# Altium schematic sheet music_51.SchDoc
size A3; Organization: Altium Limited; Address1: L3, 12a Rodborough Rd; Address2: Frenchs Forest; Address3: NSW; Address4: Australia 2086
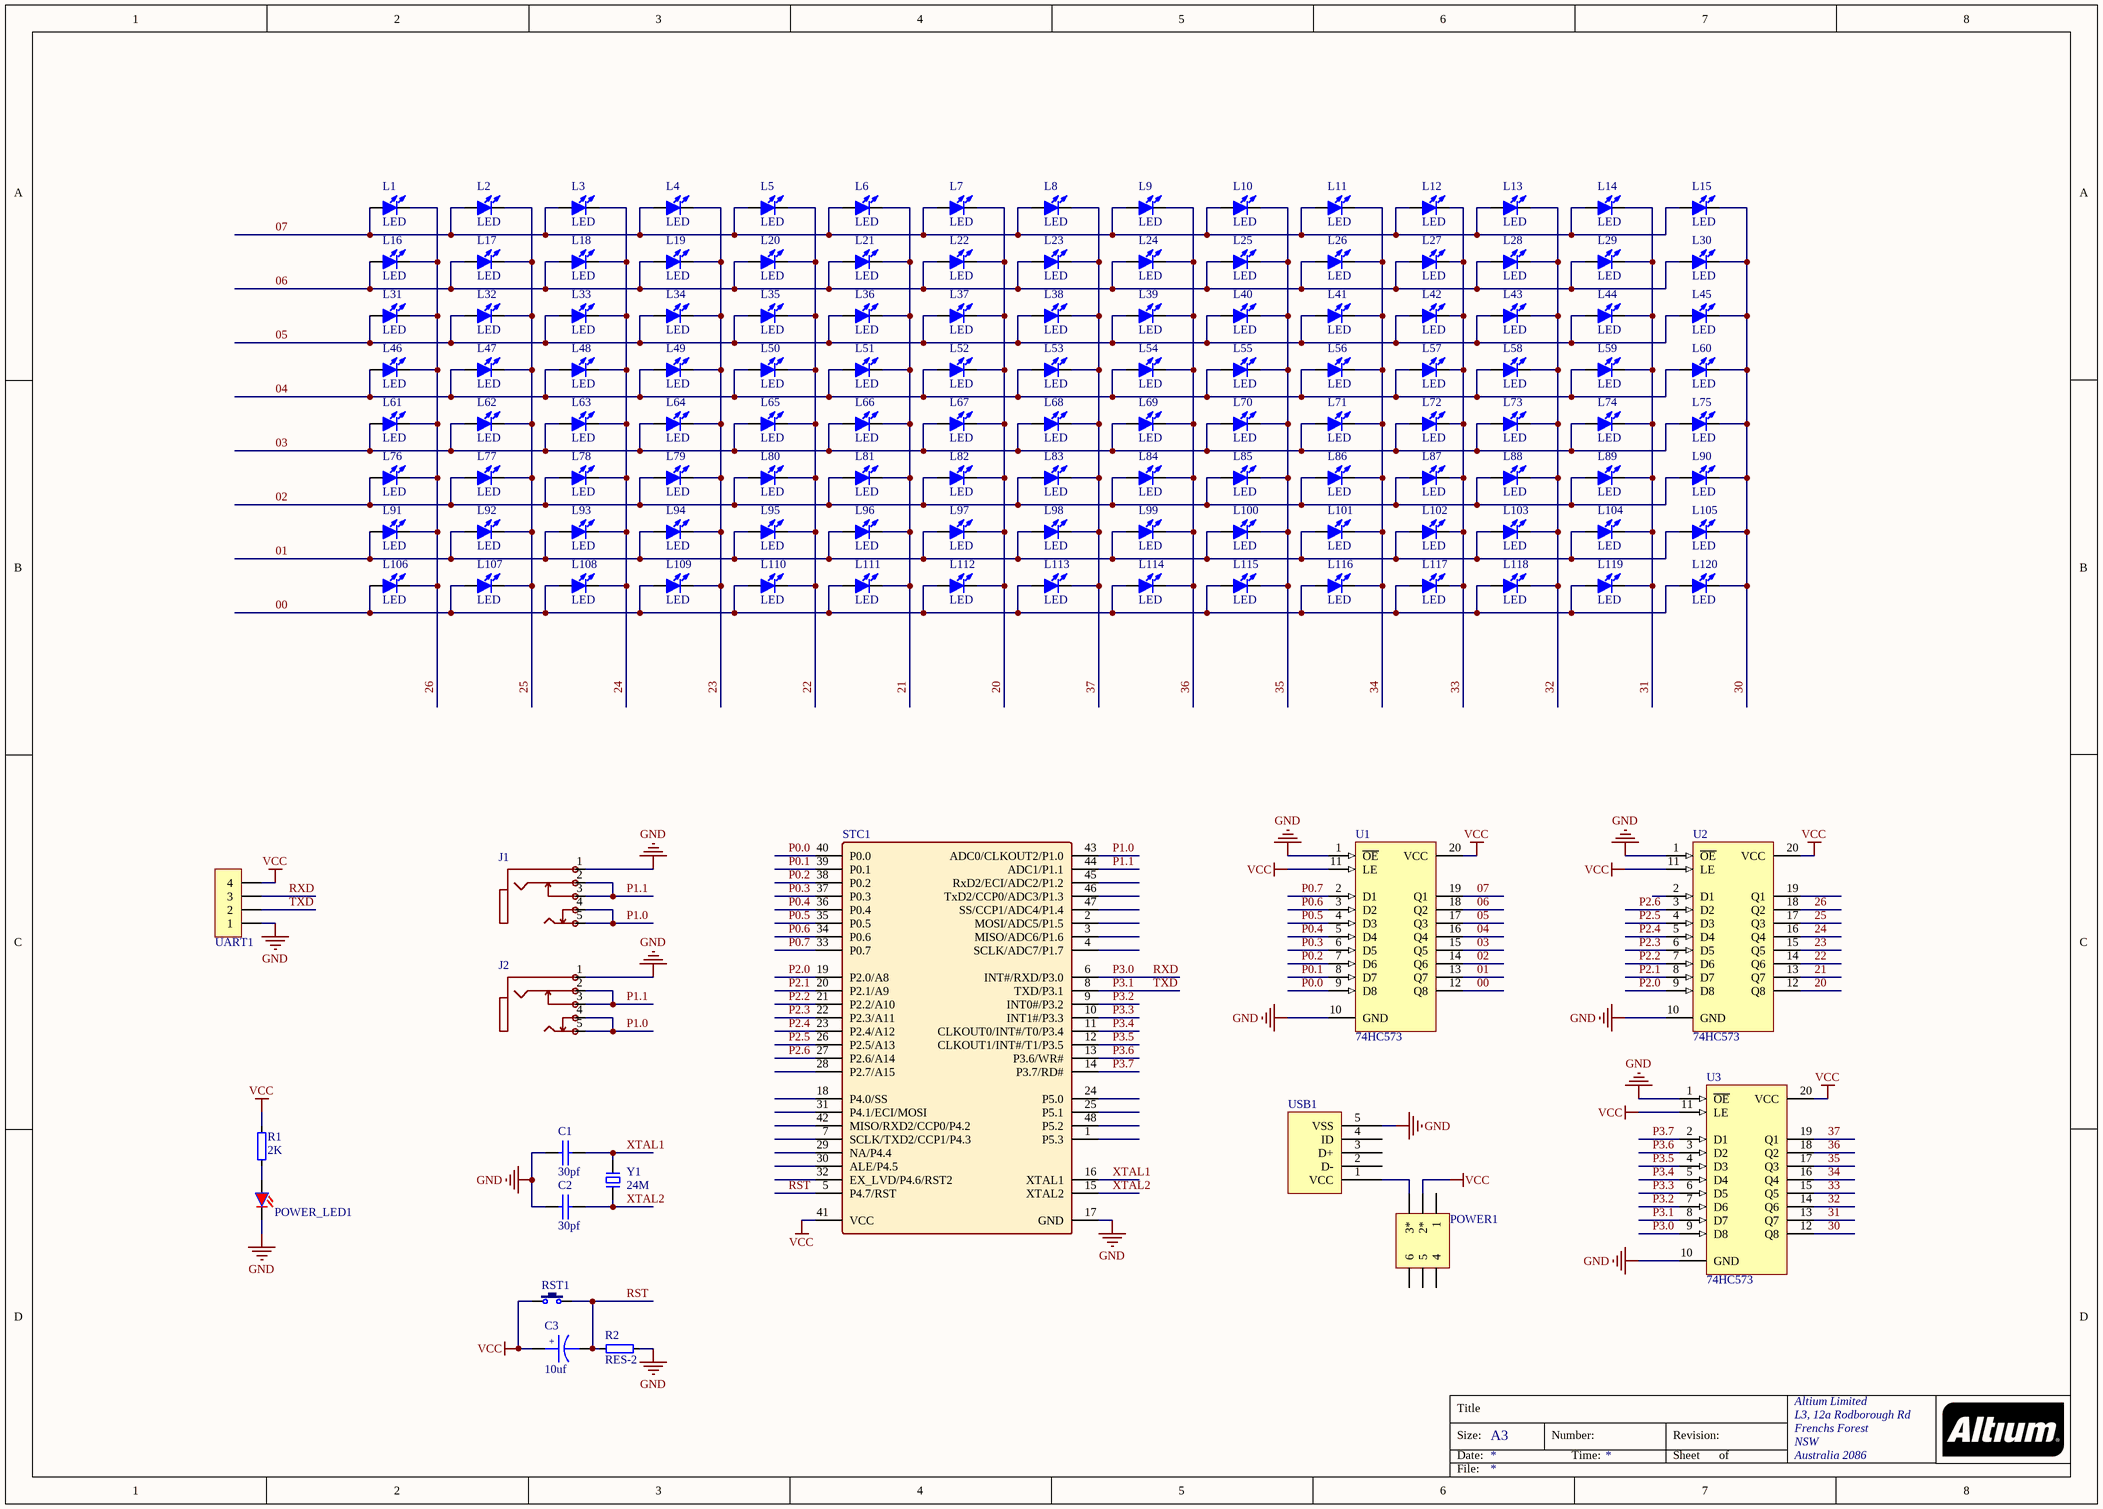
[diagram p0: music_51.SchDoc]

## Parts
C1  30pf  [CAP-0805]
C2  30pf  [CAP-0805]
C3  10uf  [CAP-0805]
J1  PJ-307C  [PJ-307C]  (value not drawn)
J2  PJ-307C  [PJ-307C]  (value not drawn)
L1  LED  [LED]
L2  LED  [LED]
L3  LED  [LED]
L4  LED  [LED]
L5  LED  [LED]
L6  LED  [LED]
L7  LED  [LED]
L8  LED  [LED]
L9  LED  [LED]
L10  LED  [LED]
L11  LED  [LED]
L12  LED  [LED]
L13  LED  [LED]
L14  LED  [LED]
L15  LED  [LED]
L16  LED  [LED]
L17  LED  [LED]
L18  LED  [LED]
L19  LED  [LED]
L20  LED  [LED]
L21  LED  [LED]
L22  LED  [LED]
L23  LED  [LED]
L24  LED  [LED]
L25  LED  [LED]
L26  LED  [LED]
L27  LED  [LED]
L28  LED  [LED]
L29  LED  [LED]
L30  LED  [LED]
L31  LED  [LED]
L32  LED  [LED]
L33  LED  [LED]
L34  LED  [LED]
L35  LED  [LED]
L36  LED  [LED]
L37  LED  [LED]
L38  LED  [LED]
L39  LED  [LED]
L40  LED  [LED]
L41  LED  [LED]
L42  LED  [LED]
L43  LED  [LED]
L44  LED  [LED]
L45  LED  [LED]
L46  LED  [LED]
L47  LED  [LED]
L48  LED  [LED]
L49  LED  [LED]
L50  LED  [LED]
L51  LED  [LED]
L52  LED  [LED]
L53  LED  [LED]
L54  LED  [LED]
L55  LED  [LED]
L56  LED  [LED]
L57  LED  [LED]
L58  LED  [LED]
L59  LED  [LED]
L60  LED  [LED]
L61  LED  [LED]
L62  LED  [LED]
L63  LED  [LED]
L64  LED  [LED]
L65  LED  [LED]
L66  LED  [LED]
L67  LED  [LED]
L68  LED  [LED]
L69  LED  [LED]
L70  LED  [LED]
L71  LED  [LED]
L72  LED  [LED]
L73  LED  [LED]
L74  LED  [LED]
L75  LED  [LED]
L76  LED  [LED]
L77  LED  [LED]
L78  LED  [LED]
L79  LED  [LED]
L80  LED  [LED]
L81  LED  [LED]
L82  LED  [LED]
L83  LED  [LED]
L84  LED  [LED]
L85  LED  [LED]
L86  LED  [LED]
L87  LED  [LED]
L88  LED  [LED]
L89  LED  [LED]
L90  LED  [LED]
L91  LED  [LED]
L92  LED  [LED]
L93  LED  [LED]
L94  LED  [LED]
L95  LED  [LED]
L96  LED  [LED]
L97  LED  [LED]
L98  LED  [LED]
L99  LED  [LED]
L100  LED  [LED]
L101  LED  [LED]
L102  LED  [LED]
L103  LED  [LED]
L104  LED  [LED]
L105  LED  [LED]
L106  LED  [LED]
L107  LED  [LED]
L108  LED  [LED]
L109  LED  [LED]
L110  LED  [LED]
L111  LED  [LED]
L112  LED  [LED]
L113  LED  [LED]
L114  LED  [LED]
L115  LED  [LED]
L116  LED  [LED]
L117  LED  [LED]
L118  LED  [LED]
L119  LED  [LED]
L120  LED  [LED]
POWER1  SWITCH  [KEY6]  (value not drawn)
POWER_LED1  LED_Red  [LED]  (value not drawn)
R1  2K  [RES-S0805]
R2  RES-2  [RES-S0805]
RST1  Key  [KEY4]  (value not drawn)
STC1  STC12C5A60S2  [LQPF48_7*7]  (value not drawn)
U1  74HC573  [SOIC-20]
U2  74HC573  [SOIC-20]
U3  74HC573  [SOIC-20]
UART1  Header 1*4  [Header 1*4]  (value not drawn)
USB1  USB_M  [MICRO_USB]  (value not drawn)
Y1  24M  [XTAL]

## Nets
GND: C1.2 C2.1 J1.1 J2.1 POWER_LED1.2(K) R2.2 STC1.17(GND) U1.1(~{OE}) U1.10(GND) U2.1(~{OE}) U2.10(GND) U3.1(~{OE}) U3.10(GND) UART1.1 USB1.5(VSS)
VCC: C3.1 POWER1.2(2*) R1.1 RST1.1 STC1.41(VCC) U1.11(LE) U1.20(VCC) U2.11(LE) U2.20(VCC) U3.11(LE) U3.20(VCC) UART1.4
00: L106.1(A) L107.1(A) L108.1(A) L109.1(A) L110.1(A) L111.1(A) L112.1(A) L113.1(A) L114.1(A) L115.1(A) L116.1(A) L117.1(A) L118.1(A) L119.1(A) L120.1(A) U1.12(Q8)
01: L91.1(A) L92.1(A) L93.1(A) L94.1(A) L95.1(A) L96.1(A) L97.1(A) L98.1(A) L99.1(A) L100.1(A) L101.1(A) L102.1(A) L103.1(A) L104.1(A) L105.1(A) U1.13(Q7)
02: L76.1(A) L77.1(A) L78.1(A) L79.1(A) L80.1(A) L81.1(A) L82.1(A) L83.1(A) L84.1(A) L85.1(A) L86.1(A) L87.1(A) L88.1(A) L89.1(A) L90.1(A) U1.14(Q6)
03: L61.1(A) L62.1(A) L63.1(A) L64.1(A) L65.1(A) L66.1(A) L67.1(A) L68.1(A) L69.1(A) L70.1(A) L71.1(A) L72.1(A) L73.1(A) L74.1(A) L75.1(A) U1.15(Q5)
04: L46.1(A) L47.1(A) L48.1(A) L49.1(A) L50.1(A) L51.1(A) L52.1(A) L53.1(A) L54.1(A) L55.1(A) L56.1(A) L57.1(A) L58.1(A) L59.1(A) L60.1(A) U1.16(Q4)
05: L31.1(A) L32.1(A) L33.1(A) L34.1(A) L35.1(A) L36.1(A) L37.1(A) L38.1(A) L39.1(A) L40.1(A) L41.1(A) L42.1(A) L43.1(A) L44.1(A) L45.1(A) U1.17(Q3)
06: L16.1(A) L17.1(A) L18.1(A) L19.1(A) L20.1(A) L21.1(A) L22.1(A) L23.1(A) L24.1(A) L25.1(A) L26.1(A) L27.1(A) L28.1(A) L29.1(A) L30.1(A) U1.18(Q2)
07: L1.1(A) L2.1(A) L3.1(A) L4.1(A) L5.1(A) L6.1(A) L7.1(A) L8.1(A) L9.1(A) L10.1(A) L11.1(A) L12.1(A) L13.1(A) L14.1(A) L15.1(A) U1.19(Q1)
20: L7.2(K) L22.2(K) L37.2(K) L52.2(K) L67.2(K) L82.2(K) L97.2(K) L112.2(K) U2.12(Q8)
21: L6.2(K) L21.2(K) L36.2(K) L51.2(K) L66.2(K) L81.2(K) L96.2(K) L111.2(K) U2.13(Q7)
22: L5.2(K) L20.2(K) L35.2(K) L50.2(K) L65.2(K) L80.2(K) L95.2(K) L110.2(K) U2.14(Q6)
23: L4.2(K) L19.2(K) L34.2(K) L49.2(K) L64.2(K) L79.2(K) L94.2(K) L109.2(K) U2.15(Q5)
24: L3.2(K) L18.2(K) L33.2(K) L48.2(K) L63.2(K) L78.2(K) L93.2(K) L108.2(K) U2.16(Q4)
25: L2.2(K) L17.2(K) L32.2(K) L47.2(K) L62.2(K) L77.2(K) L92.2(K) L107.2(K) U2.17(Q3)
26: L1.2(K) L16.2(K) L31.2(K) L46.2(K) L61.2(K) L76.2(K) L91.2(K) L106.2(K) U2.18(Q2)
30: L15.2(K) L30.2(K) L45.2(K) L60.2(K) L75.2(K) L90.2(K) L105.2(K) L120.2(K) U3.12(Q8)
31: L14.2(K) L29.2(K) L44.2(K) L59.2(K) L74.2(K) L89.2(K) L104.2(K) L119.2(K) U3.13(Q7)
32: L13.2(K) L28.2(K) L43.2(K) L58.2(K) L73.2(K) L88.2(K) L103.2(K) L118.2(K) U3.14(Q6)
33: L12.2(K) L27.2(K) L42.2(K) L57.2(K) L72.2(K) L87.2(K) L102.2(K) L117.2(K) U3.15(Q5)
34: L11.2(K) L26.2(K) L41.2(K) L56.2(K) L71.2(K) L86.2(K) L101.2(K) L116.2(K) U3.16(Q4)
35: L10.2(K) L25.2(K) L40.2(K) L55.2(K) L70.2(K) L85.2(K) L100.2(K) L115.2(K) U3.17(Q3)
36: L9.2(K) L24.2(K) L39.2(K) L54.2(K) L69.2(K) L84.2(K) L99.2(K) L114.2(K) U3.18(Q2)
37: L8.2(K) L23.2(K) L38.2(K) L53.2(K) L68.2(K) L83.2(K) L98.2(K) L113.2(K) U3.19(Q1)
P0.0: STC1.40(P0.0) U1.9(D8)
P0.1: STC1.39(P0.1) U1.8(D7)
P0.2: STC1.38(P0.2) U1.7(D6)
P0.3: STC1.37(P0.3) U1.6(D5)
P0.4: STC1.36(P0.4) U1.5(D4)
P0.5: STC1.35(P0.5) U1.4(D3)
P0.6: STC1.34(P0.6) U1.3(D2)
P0.7: STC1.33(P0.7) U1.2(D1)
P1.0: J1.4 J1.5 J2.4 J2.5 STC1.43(ADC0/CLKOUT2/P1.0)
P1.1: J1.2 J1.3 J2.2 J2.3 STC1.44(ADC1/P1.1)
P2.0: STC1.19(P2.0/A8) U2.9(D8)
P2.1: STC1.20(P2.1/A9) U2.8(D7)
P2.2: STC1.21(P2.2/A10) U2.7(D6)
P2.3: STC1.22(P2.3/A11) U2.6(D5)
P2.4: STC1.23(P2.4/A12) U2.5(D4)
P2.5: STC1.26(P2.5/A13) U2.4(D3)
P2.6: STC1.27(P2.6/A14) U2.3(D2)
P3.0: STC1.6(INT#/RXD/P3.0) U3.9(D8) UART1.3  [also labelled RXD]
P3.1: STC1.8(TXD/P3.1) U3.8(D7) UART1.2  [also labelled TXD]
P3.2: STC1.9(INT0#/P3.2) U3.7(D6)
P3.3: STC1.10(INT1#/P3.3) U3.6(D5)
P3.4: STC1.11(CLKOUT0/INT#/T0/P3.4) U3.5(D4)
P3.5: STC1.12(CLKOUT1/INT#/T1/P3.5) U3.4(D3)
P3.6: STC1.13(P3.6/WR#) U3.3(D2)
P3.7: STC1.14(P3.7/RD#) U3.2(D1)
RST: C3.2 R2.1 RST1.2 STC1.5(P4.7/RST)
XTAL1: C1.1 STC1.16(XTAL1) Y1.2
XTAL2: C2.2 STC1.15(XTAL2) Y1.1
NetPOWER1_3: POWER1.3(3*) USB1.1(VCC)
NetPOWER_LED1_1: POWER_LED1.1(A) R1.2

Not connected (* = marked no-connect by the designer): POWER1 1 4 5 6; STC1 1(P5.3) 2(MOSI/ADC5/P1.5) 3(MISO/ADC6/P1.6) 4(SCLK/ADC7/P1.7) 7(SCLK/TXD2/CCP1/P4.3) 18(P4.0/SS) 24(P5.0) 25(P5.1) 28(P2.7/A15) 29(NA/P4.4) 30(ALE/P4.5) 31(P4.1/ECI/MOSI) 32(EX_LVD/P4.6/RST2) 42(MISO/RXD2/CCP0/P4.2) 45(RxD2/ECI/ADC2/P1.2) 46(TxD2/CCP0/ADC3/P1.3) 47(SS/CCP1/ADC4/P1.4) 48(P5.2); U2 2(D1) 19(Q1); USB1 2(D-) 3(D+) 4(ID)

## Notes on the sheet
- Title
- Size:
- Date:
- A3
- Number:
- Time:
- Revision:
- Sheet
- of
- File:
- (in symbol Cap3+) +

## Library data of the parts
C1 C2 = Cap
C3 = Cap3+
R1 = RES-2
Y1 = 晶振